# Altium project PS3604LR.PrjPcb (part 1 of 3)
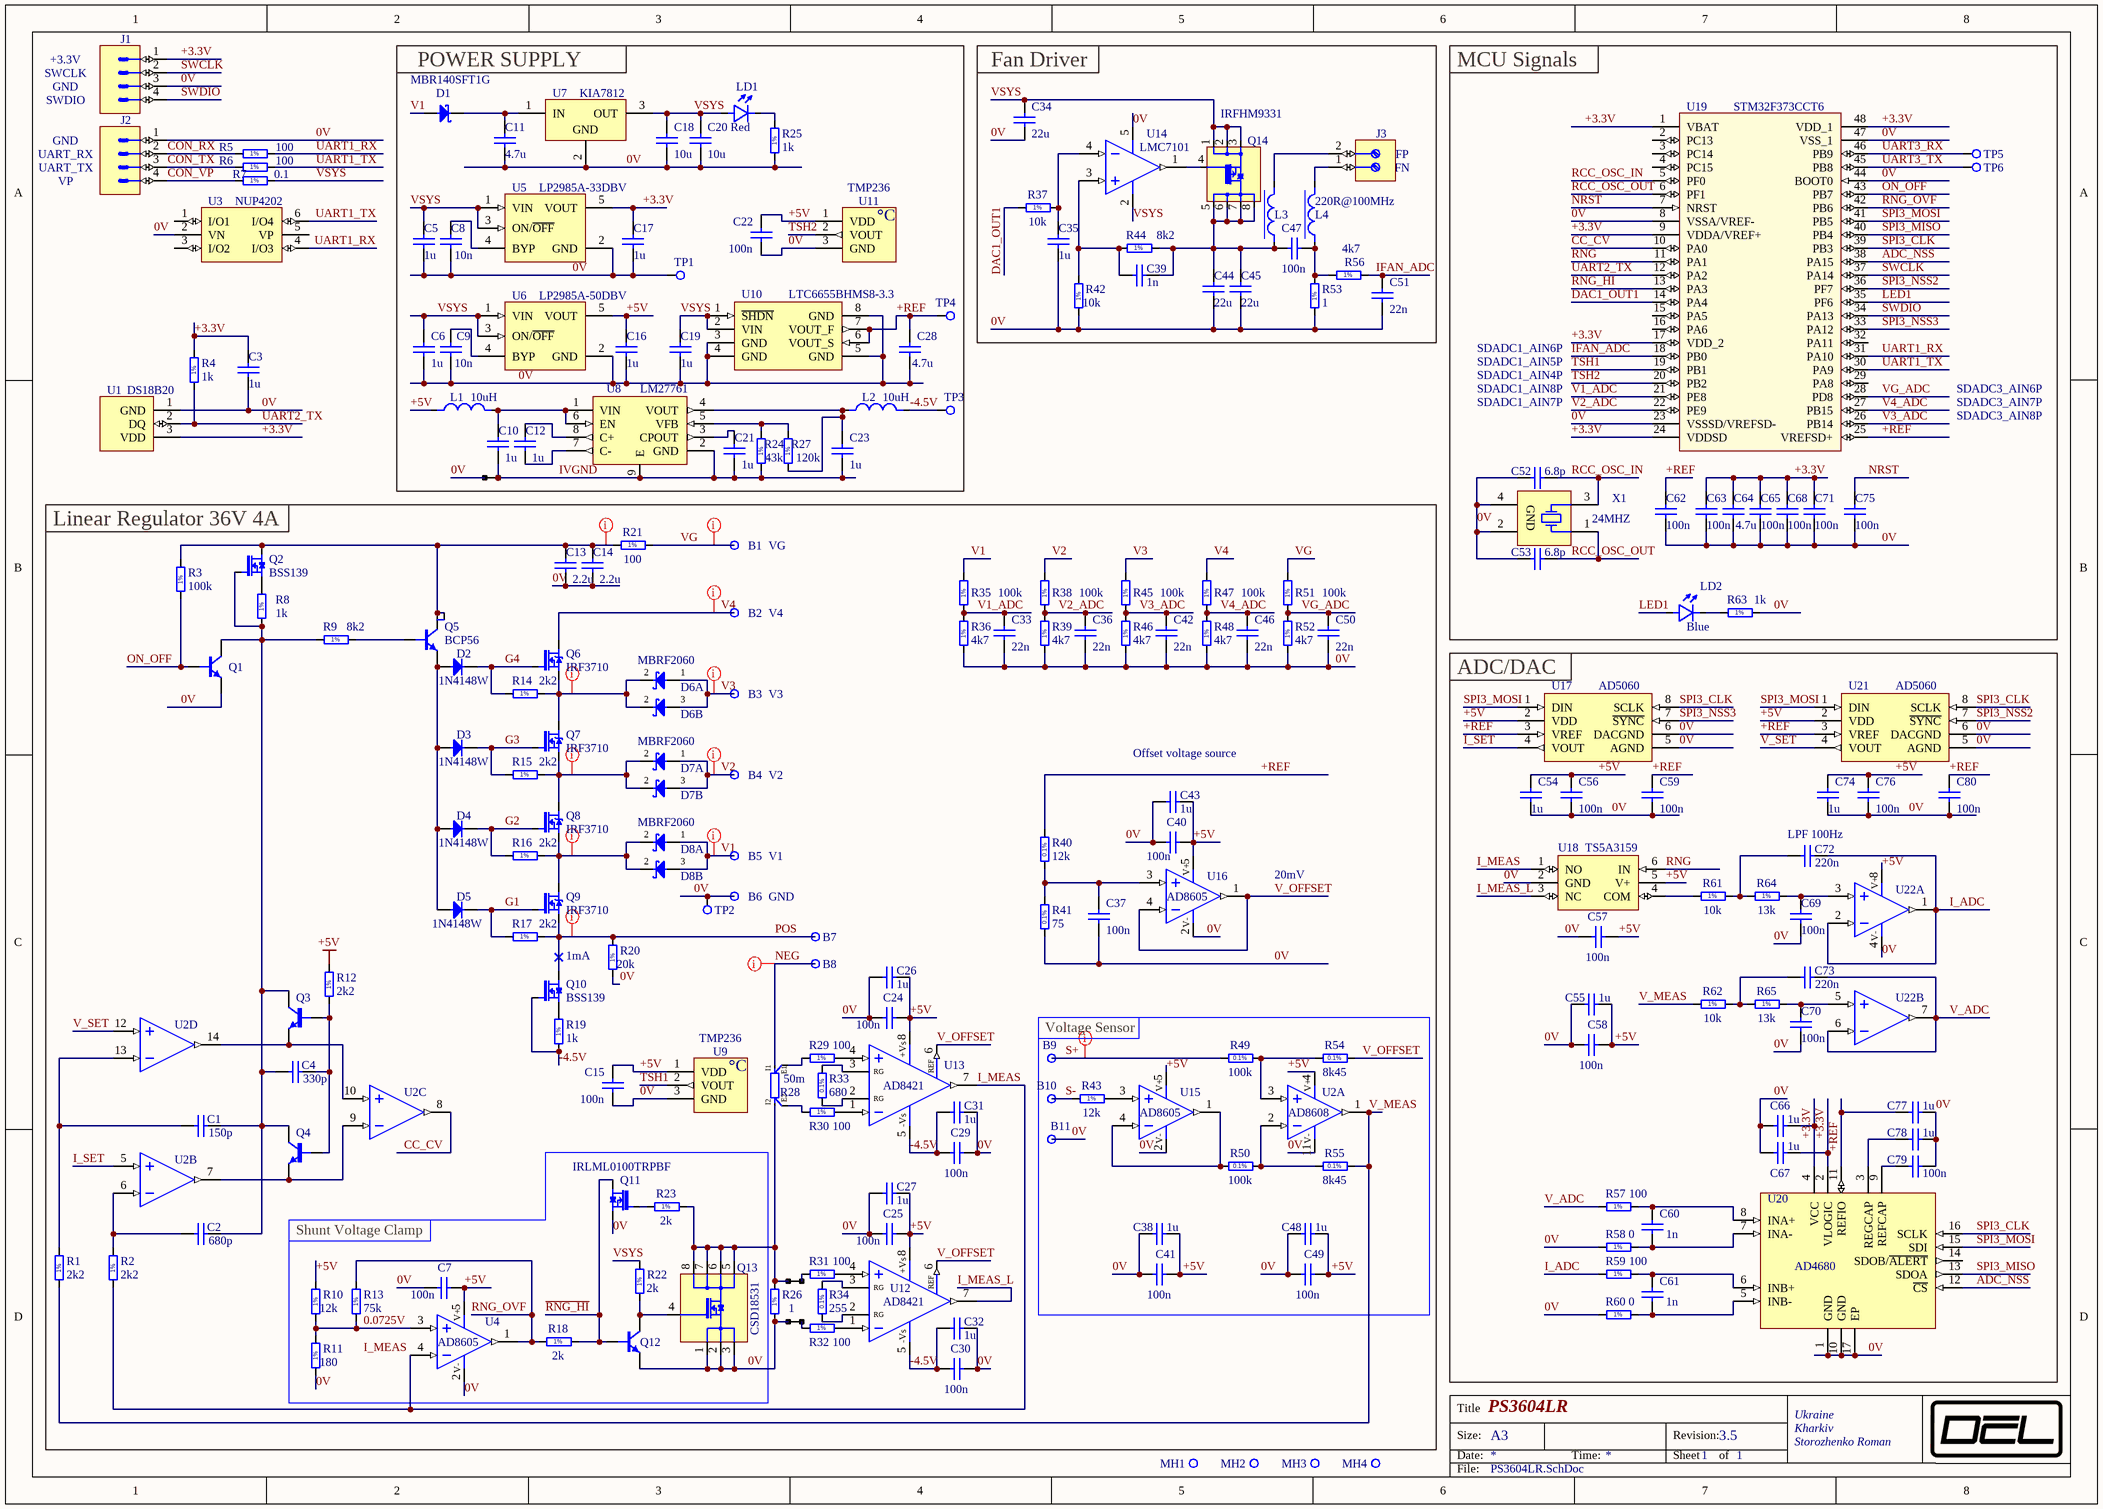
[diagram p0: PS3604LR.SchDoc]
1 sheet, 223 parts. Net scope: global (net labels, ports and power ports of the same name join across sheets).
Board file: PS3604LR.PcbDoc

## Sheet PS3604LR.SchDoc: PS3604LR
size A3; Author: Storozhenko Roman; CompanyName: D_EL; DrawnBy: Storozhenko Roman; Address1: Ukraine; Address2: Kharkiv; Revision: 3.5; SheetNumber: 1; SheetTotal: 1

### Parts
B1  VG  [c250h130]
B2  V4  [c250h130]
B3  V3  [c250h130]
B4  V2  [c250h130]
B5  V1  [c250h130]
B6  GND  [c250h130]
B7  P  [c320h180]  (value not drawn)
B8  N  [c320h180]  (value not drawn)
B9  Plated Hole  [c150h100]  (value not drawn)
B10  Plated Hole  [c150h100]  (value not drawn)
B11  Plated Hole  [c150h100]  (value not drawn)
C1  150p  [CAPC2012X135N]
C2  680p  [CAPC2012X135N]
C3  1u  [CAPC1005X55N]
C4  330p  [CAPC2012X135N]
C5  1u  [CAPC1005X55N]
C6  1u  [CAPC1005X55N]
C7  100n  [CAPC1005X55N]
C8  10n  [CAPC1005X55N]
C9  10n  [CAPC1005X55N]
C10  1u  [CAPC1005X55N]
C11  4.7u  [CAPC3216X140N]
C12  1u  [CAPC1005X55N]
C13  2.2u  [CAPC3216X140N]
C14  2.2u  [CAPC3216X140N]
C15  100n  [CAPC1005X55N]
C16  1u  [CAPC1005X55N]
C17  1u  [CAPC1005X55N]
C18  10u  [CAPC3216X140N]
C19  1u  [CAPC1005X55N]
C20  10u  [CAPC3216X140N]
C21  1u  [CAPC1005X55N]
C22  100n  [CAPC1005X55N]
C23  1u  [CAPC1005X55N]
C24  100n  [CAPC1005X55N]
C25  100n  [CAPC1005X55N]
C26  1u  [CAPC1005X55N]
C27  1u  [CAPC1005X55N]
C28  4.7u  [CAPC1005X55N]
C29  100n  [CAPC1005X55N]
C30  100n  [CAPC1005X55N]
C31  1u  [CAPC1005X55N]
C32  1u  [CAPC1005X55N]
C33  22n  [CAPC1005X55N]
C34  22u  [CAPC3216X100N]
C35  1u  [CAPC1005X55N]
C36  22n  [CAPC1005X55N]
C37  100n  [CAPC1005X55N]
C38  1u  [CAPC1005X55N]
C39  1n  [CAPC1005X55N]
C40  100n  [CAPC1005X55N]
C41  100n  [CAPC1005X55N]
C42  22n  [CAPC1005X55N]
C43  1u  [CAPC1005X55N]
C44  22u  [CAPC3216X100N]
C45  22u  [CAPC3216X100N]
C46  22n  [CAPC1005X55N]
C47  100n  [CAPC1005X55N]
C48  1u  [CAPC1005X55N]
C49  100n  [CAPC1005X55N]
C50  22n  [CAPC1005X55N]
C51  22n  [CAPC1005X55N]
C52  6.8p  [CAPC1005X55N]
C53  6.8p  [CAPC1005X55N]
C54  1u  [CAPC1005X55N]
C55  1u  [CAPC1005X55N]
C56  100n  [CAPC1005X55N]
C57  100n  [CAPC1005X55N]
C58  100n  [CAPC1005X55N]
C59  100n  [CAPC1005X55N]
C60  1n  [CAPC1005X55N]
C61  1n  [CAPC1005X55N]
C62  100n  [CAPC1005X55N]
C63  100n  [CAPC1005X55N]
C64  4.7u  [CAPC1005X55N]
C65  100n  [CAPC1005X55N]
C66  1u  [CAPC1005X55N]
C67  1u  [CAPC1005X55N]
C68  100n  [CAPC1005X55N]
C69  100n  [CAPC1005X55N]
C70  100n  [CAPC1005X55N]
C71  100n  [CAPC1005X55N]
C72  220n  [CAPC1005X55N]
C73  220n  [CAPC1005X55N]
C74  1u  [CAPC1005X55N]
C75  100n  [CAPC1005X55N]
C76  100n  [CAPC1005X55N]
C77  1u  [CAPC1005X55N]
C78  1u  [CAPC1005X55N]
C79  100n  [CAPC1005X55N]
C80  100n  [CAPC1005X55N]
D1  MBR140SFT1G  [SOD-123FL]
D2  1N4148W  [SOD3715X145N]
D3  1N4148W  [SOD3715X145N]
D4  1N4148W  [SOD3715X145N]
D5  1N4148W  [SOD3715X145N]
D6  MBRF2060  [TO-220-H-OUTSIDE]  (parts A,B of 2)
D7  MBRF2060  [TO-220-H-OUTSIDE]  (parts A,B of 2)
D8  MBRF2060  [TO-220-H-OUTSIDE]  (parts A,B of 2)
J1  Header 4  [3M_929550-0104-EU]  (value not drawn)
J2  SPOX  [MOLEX_22-03-5045]  (value not drawn)
J3  (no value)  [PHOENIX_1725656]
L1  10uH  [INDC1608X95N]
L2  10uH  [INDC1608X95N]
L3  220R@100MHz  [INDC1608X95N]  (value not drawn)
L4  220R@100MHz  [INDC1608X95N]
LD1  Red  [LEDC1608X80N_RED]
LD2  Blue  [LEDC1608X80N_BLUE]
MH1  Non Plated Hole  [MTG600H320V8P]  (value not drawn)
MH2  Non Plated Hole  [MTG600H320V8P]  (value not drawn)
MH3  Non Plated Hole  [MTG600H320V8P]  (value not drawn)
MH4  Non Plated Hole  [MTG600H320V8P]  (value not drawn)
n1  Net Tie  [NetTie_025_04]  (value not drawn)  (net tie, no BOM)
n2  Net Tie  [NetTie_025_04]  (value not drawn)  (net tie, no BOM)
n3  Net Tie  [NetTie_025_04]  (value not drawn)  (net tie, no BOM)
Q1  MMBT5551  [SOT95P240X130-3N]  (value not drawn)
Q2  BSS139  [SOT95P240X110-3N]
Q3  MMBT5551  [SOT95P240X130-3N]  (value not drawn)
Q4  MMBT5551  [SOT95P240X130-3N]  (value not drawn)
Q5  BCP56  [SOT230P700X180-4N]
Q6  IRF3710  [TO-220-H-OUTSIDE]
Q7  IRF3710  [TO-220-H-OUTSIDE]
Q8  IRF3710  [TO-220-H-OUTSIDE]
Q9  IRF3710  [TO-220-H-OUTSIDE]
Q10  BSS139  [SOT95P240X110-3N]
Q11  IRLML0100TRPBF  [SOT95P237X112-3N]
Q12  MMBT5551  [SOT95P240X130-3N]  (value not drawn)
Q13  CSD18531  [DFN-5X6-8L]
Q14  IRFHM9331  [PQFN50P300X300X100_HS-9N]
R1  2k2  [RESC1005X40N]
R2  2k2  [RESC1005X40N]
R3  100k  [RESC2012X60N]
R4  1k  [RESC1005X40N]
R5  100  [RESC1005X40N]
R6  100  [RESC1005X40N]
R7  0.1  [RESC1608X55N]
R8  1k  [RESC1005X40N]
R9  8k2  [RESC1005X40N]
R10  12k  [RESC1005X40N]
R11  180  [RESC1005X40N]
R12  2k2  [RESC1005X40N]
R13  75k  [RESC1005X40N]
R14  2k2  [RESC2012X60N]
R15  2k2  [RESC2012X60N]
R16  2k2  [RESC2012X60N]
R17  2k2  [RESC2012X60N]
R18  2k  [RESC1005X40N]
R19  1k  [RESC1608X55N]
R20  20k  [RESC2012X60N]
R21  100  [RESC2012X60N]
R22  2k  [RESC1005X40N]
R23  2k  [RESC1005X40N]
R24  43k  [RESC1005X40N]
R25  1k  [RESC1005X40N]
R26  1  [RESC6331X70N]
R27  120k  [RESC1005X40N]
R28  50m  [FC4L64_OHM]
R29  100  [RESC1005X40N]
R30  100  [RESC1005X40N]
R31  100  [RESC1005X40N]
R32  100  [RESC1005X40N]
R33  680  [RESC1005X40N]
R34  255  [RESC1005X40N]
R35  100k  [RESC2012X60N]
R36  4k7  [RESC1005X40N]
R37  10k  [RESC1005X40N]
R38  100k  [RESC2012X60N]
R39  4k7  [RESC1005X40N]
R40  12k  [RESC1005X40N]
R41  75  [RESC1005X40N]
R42  10k  [RESC1005X40N]
R43  12k  [RESC1005X40N]
R44  8k2  [RESC1005X40N]
R45  100k  [RESC2012X60N]
R46  4k7  [RESC1005X40N]
R47  100k  [RESC2012X60N]
R48  4k7  [RESC1005X40N]
R49  100k  [RESC1005X40N]
R50  100k  [RESC1005X40N]
R51  100k  [RESC2012X60N]
R52  4k7  [RESC1005X40N]
R53  1  [RESC2012X60N]
R54  8k45  [RESC1005X40N]
R55  8k45  [RESC1005X40N]
R56  4k7  [RESC1005X40N]
R57  100  [RESC1005X40N]
R58  0  [RESC1005X40N]
R59  100  [RESC1005X40N]
R60  0  [RESC1005X40N]
R61  10k  [RESC1005X40N]
R62  10k  [RESC1005X40N]
R63  1k  [RESC1005X40N]
R64  13k  [RESC1005X40N]
R65  13k  [RESC1005X40N]
TP1  GND  [TP_SMD_800]  (value not drawn)
TP2  GND  [TP_SMD_800]  (value not drawn)
TP3  -4.5V  [TP_SMD_800]  (value not drawn)
TP4  +REF  [TP_SMD_800]  (value not drawn)
TP5  Test Point  [TP_SMD_800]  (value not drawn)
TP6  Test Point  [TP_SMD_800]  (value not drawn)
U1  DS18B20  [TO-92-H-OUTSIDE]
U2  AD8608  [SOP65P640X110-14N]  (parts A,B,C,D of 4)
U3  NUP4202  [SOT65P220X110-6N]
U4  AD8605  [SOT95P280X145-5N]
U5  LP2985A-33DBV  [SOT95P280X145-5N]
U6  LP2985A-50DBV  [SOT95P280X145-5N]
U7  KIA7812  [TO-220-H-OUTSIDE]
U8  LM27761  [SON50P200X200X80-9N]
U9  TMP236  [SOT95P230X110-3N]
U10  LTC6655BHMS8-3.3  [SOP65P490X110-8BN]
U11  TMP236  [SOT95P230X110-3N]
U12  AD8421  [SOP65P490X110-8BN]
U13  AD8421  [SOP65P490X110-8BN]
U14  LMC7101  [SOT95P280X145-5N]
U15  AD8605  [SOT95P280X145-5N]
U16  AD8605  [SOT95P280X145-5N]
U17  AD5060  [SOT65P280X145-8N]
U18  TS5A3159  [SOT65P210X110-6N]
U19  STM32F373CCT6  [QFP50P900X900X160-48N]
U20  AD4680  [QFN50P300X300X80-17N-D]
U21  AD5060  [SOT65P280X145-8N]
U22  AD8606  [SOP65P490X110-8BN]  (value not drawn)  (parts A,B of 2)
X1  24MHZ  [OSCCC160X200X65-4N]

### Blocks framed on the sheet
POWER SUPPLY: C5 C6 C8-C12 C16-C23 C28 D1 L1 L2 LD1 n1 R24 R25 R27 TP1 TP3 TP4 U5-U8 U10 U11
Fan Driver: C34 C35 C39 C44 C45 C47 C51 J3 L3 L4 Q14 R37 R42 R44 R53 R56 U14
MCU Signals: C52 C53 C62-C65 C68 C71 C75 LD2 R63 TP5 TP6 U19 X1
Linear Regulator 36V 4A: B1-B8 C1 C2 C4 C13-C15 C24-C27 C29-C33 C36 C37 C40 C42 C43 C46 C50 D2-D8 n2 n3 Q1-Q10 R1-R3 R8 R9 R12 R14-R17 R19-R21 R26 R28-R36 R38-R41 R45-R48 R51 R52 TP2 U2 U9 U12 U13 U16
ADC/DAC: C54-C61 C66 C67 C69 C70 C72-C74 C76-C80 R57-R62 R64 R65 U17 U18 U20-U22
Voltage Sensor: B9-B11 C38 C41 C48 C49 R43 R49 R50 R54 R55 U2 U15
Shunt Voltage Clamp: C7 Q11-Q13 R10 R11 R13 R18 R22 R23 U4

### Nets
+5V: C7.1 C15.2 C16.2 C22.2 C24.1 C25.1 C26.2 C27.2 C38.2 C40.1 C41.1 C43.2 C48.2 C49.1 C54.2 C55.2 C56.2 C57.2 C58.1 C74.2 C76.2 L1.1 R10.2 R12.2 U2.4(V+) U4.5(V+) U6.5(VOUT) U9.1(VDD) U11.1(VDD) U12.8(+Vs) U13.8(+Vs) U15.5(V+) U16.5(V+) U17.2(VDD) U18.5(V+) U21.2(VDD) U22.8(V+)
0.0725V: R10.1 R11.2 R13.1 U4.3(IN+)
0V: B6.1 B11.1 C3.1 C5.1 C6.1 C7.2 C8.1 C9.1 C11.1 C13.1 C14.1 C15.1 C16.1 C17.1 C18.1 C19.1 C20.1 C22.1 C24.2 C25.2 C26.1 C27.1 C28.1 C29.1 C30.1 C31.2 C32.2 C33.1 C34.1 C35.1 C36.1 C37.1 C38.1 C40.2 C41.2 C42.1 C43.1 C44.1 C45.1 C46.1 C48.1 C49.2 C50.1 C51.1 C52.1 C53.1 C54.1 C55.1 C56.1 C57.1 C58.2 C59.1 C62.1 C63.1 C64.1 C65.1 C66.2 C67.2 C68.1 C69.1 C70.1 C71.1 C74.1 C75.1 C76.1 C77.1 C78.1 C79.1 C80.1 J1.3 J2.1 n1.1 n3.1 Q1.2(E) Q11.2(S) Q12.2(E) Q13.1(S) Q13.2(S) Q13.3(S) R11.1 R20.1 R25.1 R26.1 R36.1 R39.1 R41.1 R42.1 R46.1 R48.1 R52.1 R53.1 R58.1 R60.1 R63.2 TP1.1 TP2.1 U1.1(GND) U2.11(V-) U3.2(VN) U4.2(V-) U5.2(GND) U6.2(GND) U7.2(GND) U9.3(GND) U10.3(GND) U10.4(GND) U10.5(GND) U10.8(GND) U11.3(GND) U14.5(V-) U15.2(V-) U16.2(V-) U17.5(AGND) U17.6(DACGND) U18.2(GND) U19.8(VSSA/VREF-) U19.23(VSSSD/VREFSD-) U19.44(BOOT0) U19.47(VSS_1) U20.1(GND) U20.10(GND) U20.17(EP) U21.5(AGND) U21.6(DACGND) U22.4(V-) X1.2(GND) X1.4(GND)
+3.3V: C3.2 C17.2 C63.2 C64.2 C65.2 C66.1 C67.1 C68.2 C71.2 J1.1 R4.2 U1.3(VDD) U5.5(VOUT) U19.1(VBAT) U19.9(VDDA/VREF+) U19.17(VDD_2) U19.24(VDDSD) U19.48(VDD_1) U20.2(VLOGIC) U20.4(VCC)
+REF: C28.2 C59.2 C62.2 C77.2 C80.2 R40.2 TP4.1 U10.6(VOUT_S) U10.7(VOUT_F) U17.3(VREF) U19.25(VREFSD+) U20.11(REFIO) U21.3(VREF)
-4.5V: C29.2 C30.2 C31.1 C32.1 L2.2 Q10.1(G) R19.1 TP3.1 U12.5(-Vs) U13.5(-Vs)
ADC_NSS: U19.38(PA15) U20.12(~{CS})
CC_CV: U2.8(OUT) U19.10(PA0)
CON_RX: J2.2 R5.1
CON_TX: J2.3 R6.1
CON_VP: J2.4 R7.1
DAC1_OUT1: R37.1 U19.14(PA4)
G1: D5.1(C) Q9.1(G) R17.1
G2: D4.1(C) Q8.1(G) R16.1
G3: D3.1(C) Q7.1(G) R15.1
G4: D2.1(C) Q6.1(G) R14.1
I_ADC: C72.2 R59.1 U22.1(OUT) U22.2(IN-)
I_MEAS: R2.1 U4.4(IN-) U13.7(Vout) U18.1(NO)
I_MEAS_L: U12.7(Vout) U18.3(NC)
I_SET: U2.5(IN+) U17.4(VOUT)
IFAN_ADC: C51.2 R56.2 U19.18(PB0)
IVGND: C10.2 C21.2 C23.2 n1.2 R24.1 U8.2(GND) U8.9(E)
LED1: LD2.2(A) U19.35(PF6)
NEG: B8.1 R28.I1
NRST: C75.2 U19.7(NRST)
ON_OFF: Q1.1(B) R3.1 U19.43(PB7)
POS: B7.1 Q9.3(S) Q10.3(D) R17.2 R20.2
~{RNG_HI}: Q11.3(D) Q12.1(B) R18.2 U19.13(PA3)
RCC_OSC_IN: C52.2 U19.5(PF0) X1.3(X)
RCC_OSC_OUT: C53.2 U19.6(PF1) X1.1(X)
RNG: U18.6(IN) U19.11(PA1)
RNG_OVF: R13.2 R18.1 U4.1(OUT) U19.42(PB6)
S+: B9.1 R49.1
S-: B10.1 R43.1
SPI3_CLK: U17.8(SCLK) U19.39(PB3) U20.16(SCLK) U21.8(SCLK)
SPI3_MISO: U19.40(PB4) U20.13(SDOA)
SPI3_MOSI: U17.1(DIN) U19.41(PB5) U20.15(SDI) U21.1(DIN)
SPI3_NSS2: U19.36(PF7) U21.7(~{SYNC})
SPI3_NSS3: U17.7(~{SYNC}) U19.33(PA12)
SWCLK: J1.2 U19.37(PA14)
SWDIO: J1.4 U19.34(PA13)
TSH1: U9.2(VOUT) U19.19(PB1)
TSH2: U11.2(VOUT) U19.20(PB2)
UART1_RX: R5.2 U3.4(I/O3) U19.31(PA10)
UART1_TX: R6.2 U3.6(I/O4) U19.30(PA9)
UART2_TX: R4.1 U1.2(DQ) U19.12(PA2)
UART3_RX: TP5.1 U19.46(PB9)
UART3_TX: TP6.1 U19.45(PB8)
V1: B5.1 D1.2(A) D8.1(A) D8.3(A) R35.2
V1_ADC: C33.2 R35.1 R36.2 U19.21(PE8)
V2: B4.1 D7.1(A) D7.3(A) R38.2
V2_ADC: C36.2 R38.1 R39.2 U19.22(PE9)
V3: B3.1 D6.1(A) D6.3(A) R45.2
V3_ADC: C42.2 R45.1 R46.2 U19.26(PB14)
V4: B2.1 Q6.2(D) R47.2
V4_ADC: C46.2 R47.1 R48.2 U19.27(PB15)
V_ADC: C73.2 R57.1 U22.6(IN-) U22.7(OUT)
V_MEAS: R1.1 R55.2 R62.1 U2.1(OUT)
V_OFFSET: R54.2 U12.6(REF) U13.6(REF) U16.1(OUT) U16.4(IN-)
V_SET: U2.12(IN+) U21.4(VOUT)
VG: B1.1 R21.2 R51.2
VG_ADC: C50.2 R51.1 R52.2 U19.28(PD8)
VSYS: C5.2 C6.2 C18.2 C19.2 C20.2 C34.2 LD1.2(A) Q14.1(S) Q14.2(S) Q14.3(S) R7.2 R22.2 U5.1(VIN) U5.3(ON/~{OFF}) U6.1(VIN) U6.3(ON/~{OFF}) U7.3(OUT) U10.1(~{SHDN}) U10.2(VIN) U14.2(V+)
NetC1_1: C1.1 R1.2 U2.13(IN-)
NetC1_2: C1.2 C2.2 C4.1 Q1.3(C) Q2.1(G) Q3.3(C) Q4.3(C) R8.1 R9.1
NetC2_1: C2.1 R2.2 U2.6(IN-)
NetC4_2: C4.2 Q3.1(B) Q4.1(B) R12.1
NetC8_2: C8.2 U5.4(BYP)
NetC9_2: C9.2 U6.4(BYP)
NetC10_1: C10.1 L1.2 U8.1(VIN) U8.6(EN)
NetC11_2: C11.2 D1.1(C) U7.1(IN)
NetC12_1: C12.1 U8.8(C+)
NetC12_2: C12.2 U8.7(C-)
NetC13_2: C13.2 C14.2 Q2.3(D) Q5.2(C) Q5.4(C) R3.2 R21.1
NetC21_1: C21.1 U8.3(CPOUT)
NetC23_1: C23.1 L2.1 R27.1 U8.4(VOUT)
NetC35_2: C35.2 R37.2 U14.4(IN-)
NetC37_2: C37.2 R40.1 R41.2 U16.3(IN+)
NetC39_1: C39.1 R42.2 R44.1 U14.3(IN+)
NetC39_2: C39.2 C44.2 C45.2 C47.2 L3.1 Q14.5(D) Q14.6(D) Q14.7(D) Q14.8(D) R44.2
NetC47_1: C47.1 L4.1 R53.2 R56.1
NetC60_1: C60.1 R58.2 U20.7(INA-)
NetC60_2: C60.2 R57.2 U20.8(INA+)
NetC61_1: C61.1 R60.2 U20.5(INB-)
NetC61_2: C61.2 R59.2 U20.6(INB+)
NetC69_2: C69.2 R64.2 U22.3(IN+)
NetC70_2: C70.2 R65.2 U22.5(IN+)
NetC72_1: C72.1 R61.2 R64.1
NetC73_1: C73.1 R62.2 R65.1
NetC78_2: C78.2 U20.3(REGCAP)
NetC79_2: C79.2 U20.9(REFCAP)
NetD2_2: D2.2(A) D3.2(A) D4.2(A) D5.2(A) Q5.3(E)
NetD6_2: D6.2(COMC) Q6.3(S) Q7.2(D) R14.2
NetD7_2: D7.2(COMC) Q7.3(S) Q8.2(D) R15.2
NetD8_2: D8.2(COMC) Q8.3(S) Q9.2(D) R16.2
NetJ3_1: J3.1 L4.2
NetJ3_2: J3.2 L3.2
NetLD1_1: LD1.1(C) R25.2
NetLD2_1: LD2.1(C) R63.1
Netn2_1: n2.1 Q13.5(D) Q13.6(D) Q13.7(D) Q13.8(D) R23.2 R26.2 R28.I2
Netn2_2: n2.2 R31.1
Netn3_2: n3.2 R32.1
NetQ2_2: Q2.2(S) R8.2
NetQ3_2: Q3.2(E) U2.10(IN+) U2.14(OUT)
NetQ4_2: Q4.2(E) U2.7(OUT) U2.9(IN-)
NetQ5_1: Q5.1(B) R9.2
NetQ10_2: Q10.2(S) R19.2
NetQ11_1: Q11.1(G) R23.1
NetQ12_3: Q12.3(C) Q13.4(G) R22.1
NetQ14_4: Q14.4(S) U14.1(OUT)
NetR24_2: R24.2 R27.2 U8.5(VFB)
NetR28_E1: R28.E1 R29.1
NetR28_E2: R28.E2 R30.1
NetR29_2: R29.2 U13.4(+IN)
NetR30_2: R30.2 U13.1(-IN)
NetR31_2: R31.2 U12.4(+IN)
NetR32_2: R32.2 U12.1(-IN)
NetR33_1: R33.1 U13.2(RG)
NetR33_2: R33.2 U13.3(RG)
NetR34_1: R34.1 U12.2(RG)
NetR34_2: R34.2 U12.3(RG)
NetR43_2: R43.2 U15.3(IN+)
NetR49_2: R49.2 R54.1 U2.3(IN+)
NetR50_1: R50.1 U15.1(OUT) U15.4(IN-)
NetR50_2: R50.2 R55.1 U2.2(IN-)
NetR61_1: R61.1 U18.4(COM)

Not connected (* = marked no-connect by the designer): MH1 1; MH2 1; MH3 1; MH4 1; U3 1(I/O1) 3(I/O2) 5(VP); U19 2(PC13) 3(PC14) 4(PC15) 15(PA5) 16(PA6) 29(PA8) 32(PA11); U20 14(SDOB/~{ALERT})

### Layout directives
net class Power: NetC13_2, NetD6_2, NetD7_2, NetD8_2, POS, S+, V1, V2, V3, V4, VG
net class Shunt: NEG

### Notes on the sheet
- SWCLK
- GND
- SWDIO
- +3.3V
- UART_TX
- UART_RX
- VP
- (near J3) FN
- (near J3) FP
- SDADC1_AIN4P
- SDADC1_AIN5P
- SDADC1_AIN6P
- SDADC1_AIN8P
- SDADC1_AIN7P
- SDADC3_AIN8P
- SDADC3_AIN7P
- SDADC3_AIN6P
- (near C43) Offset voltage source
- (near C72) LPF 100Hz
- 20mV
- 1mA
- Labels drawn without touching a wire or pin: I_MEAS
- Title
- Size:
- Date:
- A3
- Time:
- Revision:
- Sheet
- of
- File:
- (in symbol R0402_0R_JUMPER) 1%
- (in symbol R0402_1K_1%_0.0625W_100PPM) 1%
- (in symbol R0402_2K2_1%_0.0625W_100PPM) 1%
- (in symbol R0402_2K_1%_0.0625W_100PPM) 1%
- (in symbol R0402_4K7_1%_0.0625W_100PPM) 1%
- (in symbol R0402_8K2_1%_0.0625W_100PPM) 1%
- (in symbol R0402_8K45_0.1%_0.063W_10PPM) 0.1%
- (in symbol R0402_10K_1%_0.0625W_100PPM) 1%
- (in symbol R0402_12K_0.1%_0.063W_10PPM) 0.1%
- (in symbol R0402_12K_1%_0.0625W_100PPM) 1%
- (in symbol R0402_13K_1%_0.0625W_100PPM) 1%
- (in symbol R0402_43K_1%_0.0625W_100PPM) 1%
- (in symbol R0402_75K_1%_0.0625W_100PPM) 1%
- (in symbol R0402_75R_0.1%_0.063W_10PPM) 0.1%
- (in symbol R0402_100K_0.1%_0.063W_10PPM) 0.1%
- (in symbol R0402_100R_1%_0.0625W_100PPM) 1%
- (in symbol R0402_120K_1%_0.0625W_100PPM) 1%
- (in symbol R0402_180R_1%_0.0625W_100PPM) 1%
- (in symbol R0402_255R_0.1%_0.063W_10PPM) 0.1%
- (in symbol R0402_680R_0.1%_0.063W_10PPM) 0.1%
- (in symbol R0603_0R1_1%_0.1W_100PPM) 1%
- (in symbol R0603_1K_1%_0.1W_100PPM) 1%
- (in symbol R0805_1R_1%_0.125W_200PPM) 1%
- (in symbol R0805_2K2_1%_0.125W_100PPM) 1%
- (in symbol R0805_20K_1%_0.125W_100PPM) 1%
- (in symbol R0805_100K_1%_0.125W_100PPM) 1%
- (in symbol R0805_100R_1%_0.125W_100PPM) 1%
- (in symbol R2512_1R0_1%_1W_100PPM) 1%
- (in symbol TMP236A2DBZR) °C